# Altium schematic sheet Camera.SchDoc
size A3; DrawnBy: James Chen; SheetNumber: 5; SheetTotal: 5
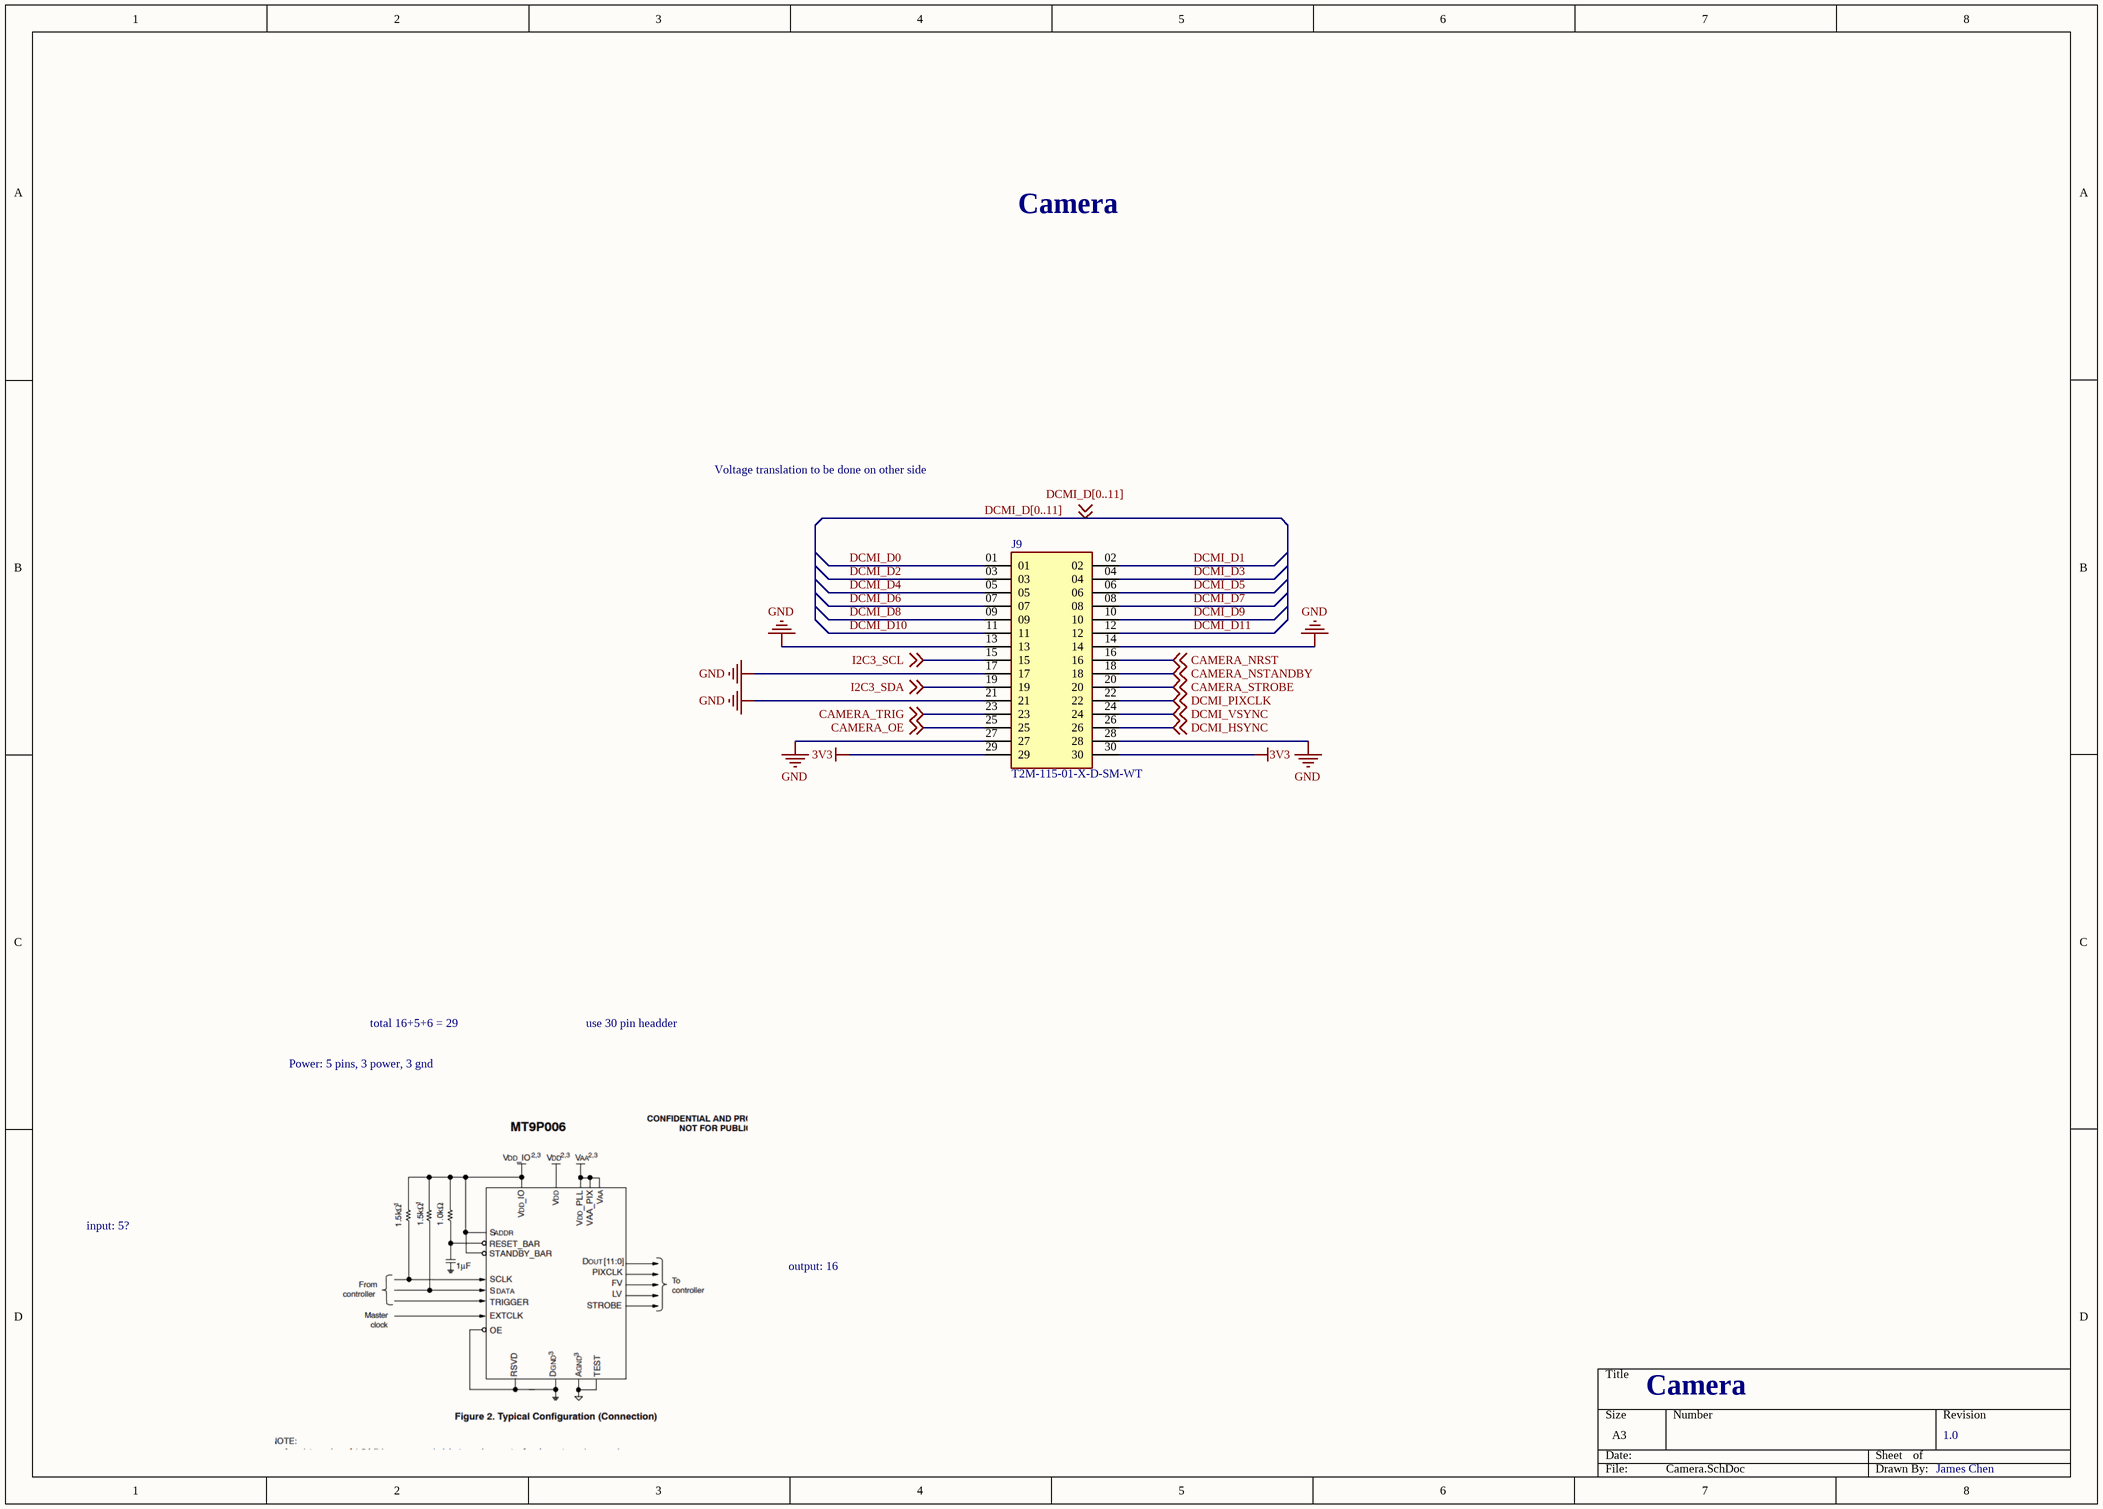
[diagram p0: Camera.SchDoc]

## Parts
J9  T2M-115-01-X-D-SM-WT  [T2M-115-01-X-D-SM-WT]

## Nets
3V3: J9.29 J9.30
GND: J9.13 J9.14 J9.17 J9.21 J9.27 J9.28
CAMERA_NRST: J9.16 ; off-sheet CAMERA_NRST
CAMERA_NSTANDBY: J9.18 ; off-sheet CAMERA_NSTANDBY
CAMERA_OE: J9.25 ; off-sheet CAMERA_OE
CAMERA_STROBE: J9.20 ; off-sheet CAMERA_STROBE
CAMERA_TRIG: J9.23 ; off-sheet CAMERA_TRIG
DCMI_D0: J9.01
DCMI_D1: J9.02
DCMI_D2: J9.03
DCMI_D3: J9.04
DCMI_D4: J9.05
DCMI_D5: J9.06
DCMI_D6: J9.07
DCMI_D7: J9.08
DCMI_D8: J9.09
DCMI_D9: J9.10
DCMI_D10: J9.11
DCMI_D11: J9.12
DCMI_HSYNC: J9.26 ; off-sheet DCMI_HSYNC
DCMI_PIXCLK: J9.22 ; off-sheet DCMI_PIXCLK
DCMI_VSYNC: J9.24 ; off-sheet DCMI_VSYNC
I2C3_SCL: J9.15 ; off-sheet I2C3_SCL
I2C3_SDA: J9.19 ; off-sheet I2C3_SDA

## Buses and harness runs
bus DCMI_D[0..11]

## Notes on the sheet
- Camera
- Voltage translation to be done on other side
- total 16+5+6 = 29
- use 30 pin headder
- Power: 5 pins, 3 power, 3 gnd
- input: 5?
- output: 16
- 1.0
- James Chen

## Library data of the parts
J9 = J-T2M-115-01-X-D-SM-WT: Headers & Wire Housings High Reliability Tiger Eye Discrete Wire Header, 2.00 mm Pitch; Manufactuer: Samtec; Distributor Part #: 200-T2M11501LDSMWT; Distributor: Mouser; Manufacturer Part #: T2M-115-01-X-D-SM-WT